# Altium schematic sheet keymap.SchDoc
size A3; Organization: Develer s.r.l.; Address1: via Mugellese 1/A; Address2: 50019 Campi Bisenzio; Address3: Firenze; Address4: ITALY; Revision: A; SheetNumber: 1; SheetTotal: 1
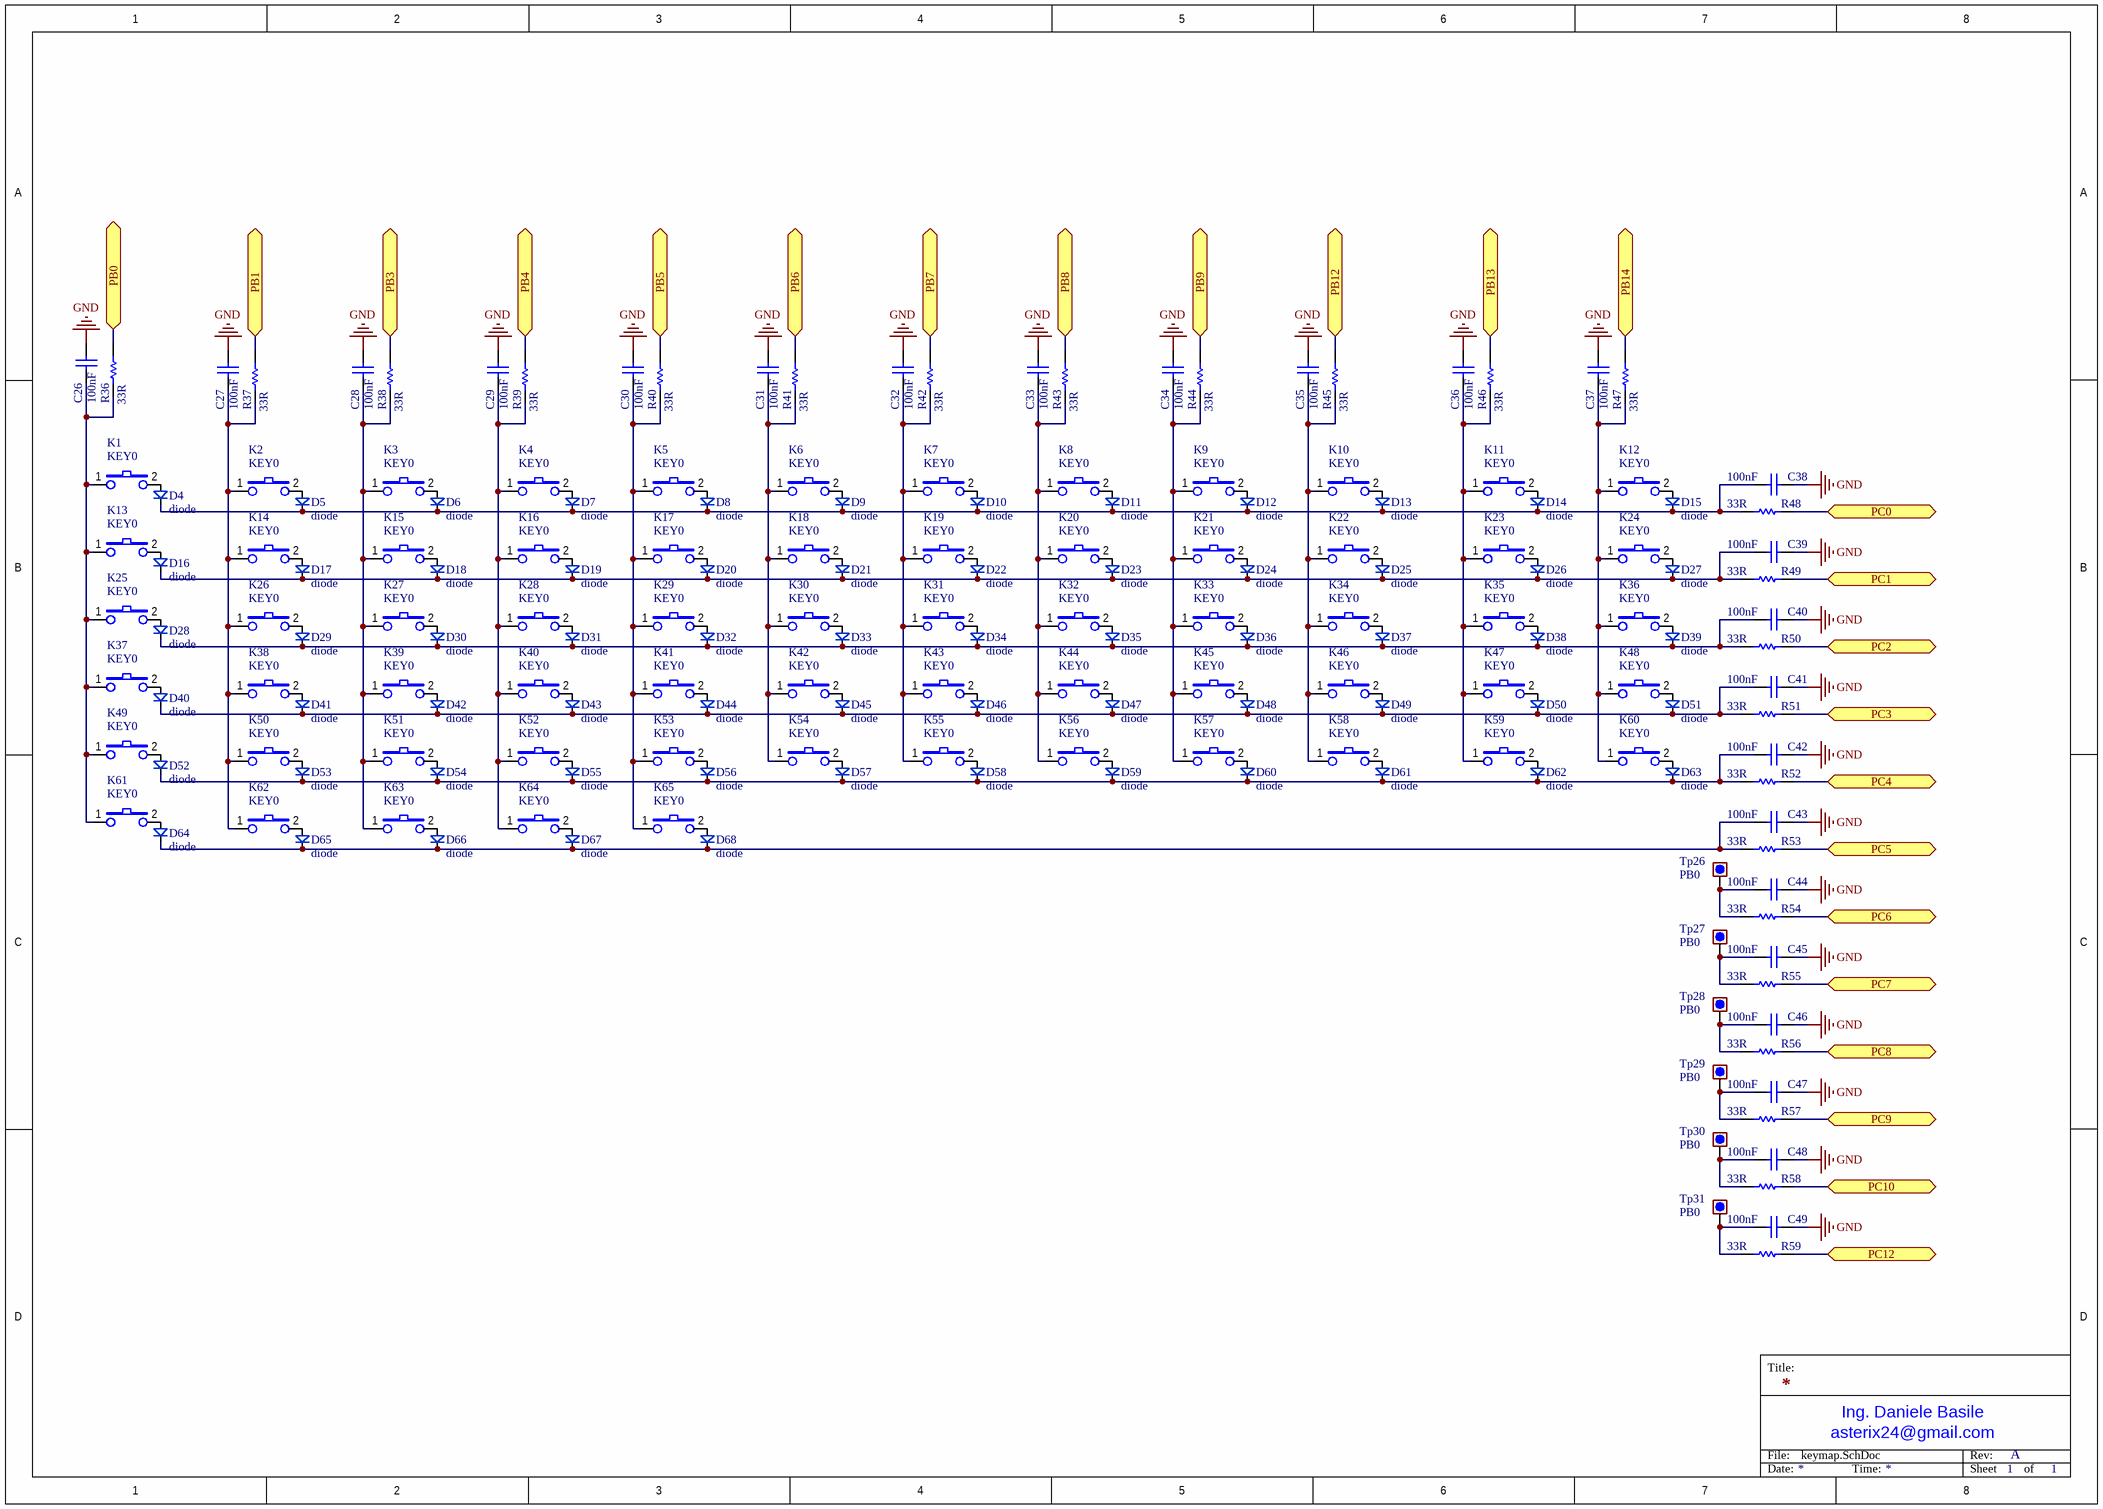
[diagram p0: keymap.SchDoc]

## Parts
C26  100nF  [0603_[1608]]
C27  100nF  [0603_[1608]]
C28  100nF  [0603_[1608]]
C29  100nF  [0603_[1608]]
C30  100nF  [0603_[1608]]
C31  100nF  [0603_[1608]]
C32  100nF  [0603_[1608]]
C33  100nF  [0603_[1608]]
C34  100nF  [0603_[1608]]
C35  100nF  [0603_[1608]]
C36  100nF  [0603_[1608]]
C37  100nF  [0603_[1608]]
C38  100nF  [0603_[1608]]
C39  100nF  [0603_[1608]]
C40  100nF  [0603_[1608]]
C41  100nF  [0603_[1608]]
C42  100nF  [0603_[1608]]
C43  100nF  [0603_[1608]]
C44  100nF  [0603_[1608]]
C45  100nF  [0603_[1608]]
C46  100nF  [0603_[1608]]
C47  100nF  [0603_[1608]]
C48  100nF  [0603_[1608]]
C49  100nF  [0603_[1608]]
D4  diode  [SOD-123]
D5  diode  [SOD-123]
D6  diode  [SOD-123]
D7  diode  [SOD-123]
D8  diode  [SOD-123]
D9  diode  [SOD-123]
D10  diode  [SOD-123]
D11  diode  [SOD-123]
D12  diode  [SOD-123]
D13  diode  [SOD-123]
D14  diode  [SOD-123]
D15  diode  [SOD-123]
D16  diode  [SOD-123]
D17  diode  [SOD-123]
D18  diode  [SOD-123]
D19  diode  [SOD-123]
D20  diode  [SOD-123]
D21  diode  [SOD-123]
D22  diode  [SOD-123]
D23  diode  [SOD-123]
D24  diode  [SOD-123]
D25  diode  [SOD-123]
D26  diode  [SOD-123]
D27  diode  [SOD-123]
D28  diode  [SOD-123]
D29  diode  [SOD-123]
D30  diode  [SOD-123]
D31  diode  [SOD-123]
D32  diode  [SOD-123]
D33  diode  [SOD-123]
D34  diode  [SOD-123]
D35  diode  [SOD-123]
D36  diode  [SOD-123]
D37  diode  [SOD-123]
D38  diode  [SOD-123]
D39  diode  [SOD-123]
D40  diode  [SOD-123]
D41  diode  [SOD-123]
D42  diode  [SOD-123]
D43  diode  [SOD-123]
D44  diode  [SOD-123]
D45  diode  [SOD-123]
D46  diode  [SOD-123]
D47  diode  [SOD-123]
D48  diode  [SOD-123]
D49  diode  [SOD-123]
D50  diode  [SOD-123]
D51  diode  [SOD-123]
D52  diode  [SOD-123]
D53  diode  [SOD-123]
D54  diode  [SOD-123]
D55  diode  [SOD-123]
D56  diode  [SOD-123]
D57  diode  [SOD-123]
D58  diode  [SOD-123]
D59  diode  [SOD-123]
D60  diode  [SOD-123]
D61  diode  [SOD-123]
D62  diode  [SOD-123]
D63  diode  [SOD-123]
D64  diode  [SOD-123]
D65  diode  [SOD-123]
D66  diode  [SOD-123]
D67  diode  [SOD-123]
D68  diode  [SOD-123]
K1  KEY0  [tactile_switch_gateron_pcb]
K2  KEY0  [tactile_switch_gateron_pcb]
K3  KEY0  [tactile_switch_gateron_pcb]
K4  KEY0  [tactile_switch_gateron_pcb]
K5  KEY0  [tactile_switch_gateron_pcb]
K6  KEY0  [tactile_switch_gateron_pcb]
K7  KEY0  [tactile_switch_gateron_pcb]
K8  KEY0  [tactile_switch_gateron_pcb]
K9  KEY0  [tactile_switch_gateron_pcb]
K10  KEY0  [tactile_switch_gateron_pcb]
K11  KEY0  [tactile_switch_gateron_pcb]
K12  KEY0  [tactile_switch_gateron_pcb]
K13  KEY0  [tactile_switch_gateron_pcb]
K14  KEY0  [tactile_switch_gateron_pcb]
K15  KEY0  [tactile_switch_gateron_pcb]
K16  KEY0  [tactile_switch_gateron_pcb]
K17  KEY0  [tactile_switch_gateron_pcb]
K18  KEY0  [tactile_switch_gateron_pcb]
K19  KEY0  [tactile_switch_gateron_pcb]
K20  KEY0  [tactile_switch_gateron_pcb]
K21  KEY0  [tactile_switch_gateron_pcb]
K22  KEY0  [tactile_switch_gateron_pcb]
K23  KEY0  [tactile_switch_gateron_pcb]
K24  KEY0  [tactile_switch_gateron_pcb]
K25  KEY0  [tactile_switch_gateron_pcb]
K26  KEY0  [tactile_switch_gateron_pcb]
K27  KEY0  [tactile_switch_gateron_pcb]
K28  KEY0  [tactile_switch_gateron_pcb]
K29  KEY0  [tactile_switch_gateron_pcb]
K30  KEY0  [tactile_switch_gateron_pcb]
K31  KEY0  [tactile_switch_gateron_pcb]
K32  KEY0  [tactile_switch_gateron_pcb]
K33  KEY0  [tactile_switch_gateron_pcb]
K34  KEY0  [tactile_switch_gateron_pcb]
K35  KEY0  [tactile_switch_gateron_pcb]
K36  KEY0  [tactile_switch_gateron_pcb]
K37  KEY0  [tactile_switch_gateron_pcb]
K38  KEY0  [tactile_switch_gateron_pcb]
K39  KEY0  [tactile_switch_gateron_pcb]
K40  KEY0  [tactile_switch_gateron_pcb]
K41  KEY0  [tactile_switch_gateron_pcb]
K42  KEY0  [tactile_switch_gateron_pcb]
K43  KEY0  [tactile_switch_gateron_pcb]
K44  KEY0  [tactile_switch_gateron_pcb]
K45  KEY0  [tactile_switch_gateron_pcb]
K46  KEY0  [tactile_switch_gateron_pcb]
K47  KEY0  [tactile_switch_gateron_pcb]
K48  KEY0  [tactile_switch_gateron_pcb]
K49  KEY0  [tactile_switch_gateron_pcb]
K50  KEY0  [tactile_switch_gateron_pcb]
K51  KEY0  [tactile_switch_gateron_pcb]
K52  KEY0  [tactile_switch_gateron_pcb]
K53  KEY0  [tactile_switch_gateron_pcb]
K54  KEY0  [tactile_switch_gateron_pcb]
K55  KEY0  [tactile_switch_gateron_pcb]
K56  KEY0  [tactile_switch_gateron_pcb]
K57  KEY0  [tactile_switch_gateron_pcb]
K58  KEY0  [tactile_switch_gateron_pcb]
K59  KEY0  [tactile_switch_gateron_pcb]
K60  KEY0  [tactile_switch_gateron_pcb]
K61  KEY0  [tactile_switch_gateron_pcb]
K62  KEY0  [tactile_switch_gateron_pcb]
K63  KEY0  [tactile_switch_gateron_pcb]
K64  KEY0  [tactile_switch_gateron_pcb]
K65  KEY0  [tactile_switch_gateron_pcb]
R36  33R  [0603_[1608]]
R37  33R  [0603_[1608]]
R38  33R  [0603_[1608]]
R39  33R  [0603_[1608]]
R40  33R  [0603_[1608]]
R41  33R  [0603_[1608]]
R42  33R  [0603_[1608]]
R43  33R  [0603_[1608]]
R44  33R  [0603_[1608]]
R45  33R  [0603_[1608]]
R46  33R  [0603_[1608]]
R47  33R  [0603_[1608]]
R48  33R  [0603_[1608]]
R49  33R  [0603_[1608]]
R50  33R  [0603_[1608]]
R51  33R  [0603_[1608]]
R52  33R  [0603_[1608]]
R53  33R  [0603_[1608]]
R54  33R  [0603_[1608]]
R55  33R  [0603_[1608]]
R56  33R  [0603_[1608]]
R57  33R  [0603_[1608]]
R58  33R  [0603_[1608]]
R59  33R  [0603_[1608]]
Tp26  PB0  [TEST_POINT_THD_D1.8MM]  (no BOM)
Tp27  PB0  [TEST_POINT_THD_D1.8MM]  (no BOM)
Tp28  PB0  [TEST_POINT_THD_D1.8MM]  (no BOM)
Tp29  PB0  [TEST_POINT_THD_D1.8MM]  (no BOM)
Tp30  PB0  [TEST_POINT_THD_D1.8MM]  (no BOM)
Tp31  PB0  [TEST_POINT_THD_D1.8MM]  (no BOM)

## Ports
PB0, PB1, PB3, PB4, PB5, PB6, PB7, PB8, PB9, PB12, PB13, PB14, PC0, PC1, PC2, PC3, PC4, PC5, PC6, PC7, PC8, PC9, PC10, PC12

## Nets
GND: C26.2 C27.2 C28.2 C29.2 C30.2 C31.2 C32.2 C33.2 C34.2 C35.2 C36.2 C37.2 C38.2 C39.2 C40.2 C41.2 C42.2 C43.2 C44.2 C45.2 C46.2 C47.2 C48.2 C49.2
PB0: R36.2 ; port PB0
PB1: R37.2 ; port PB1
PB3: R38.2 ; port PB3
PB4: R39.2 ; port PB4
PB5: R40.2 ; port PB5
PB6: R41.2 ; port PB6
PB7: R42.2 ; port PB7
PB8: R43.2 ; port PB8
PB9: R44.2 ; port PB9
PB12: R45.2 ; port PB12
PB13: R46.2 ; port PB13
PB14: R47.2 ; port PB14
PC0: R48.2 ; port PC0
PC1: R49.2 ; port PC1
PC2: R50.2 ; port PC2
PC3: R51.2 ; port PC3
PC4: R52.2 ; port PC4
PC5: R53.2 ; port PC5
PC6: R54.2 ; port PC6
PC7: R55.2 ; port PC7
PC8: R56.2 ; port PC8
PC9: R57.2 ; port PC9
PC10: R58.2 ; port PC10
PC12: R59.2 ; port PC12
NetC26_1: C26.1 K1.1 K13.1 K25.1 K37.1 K49.1 K61.1 R36.1
NetC27_1: C27.1 K2.1 K14.1 K26.1 K38.1 K50.1 K62.1 R37.1
NetC28_1: C28.1 K3.1 K15.1 K27.1 K39.1 K51.1 K63.1 R38.1
NetC29_1: C29.1 K4.1 K16.1 K28.1 K40.1 K52.1 K64.1 R39.1
NetC30_1: C30.1 K5.1 K17.1 K29.1 K41.1 K53.1 K65.1 R40.1
NetC31_1: C31.1 K6.1 K18.1 K30.1 K42.1 K54.1 R41.1
NetC32_1: C32.1 K7.1 K19.1 K31.1 K43.1 K55.1 R42.1
NetC33_1: C33.1 K8.1 K20.1 K32.1 K44.1 K56.1 R43.1
NetC34_1: C34.1 K9.1 K21.1 K33.1 K45.1 K57.1 R44.1
NetC35_1: C35.1 K10.1 K22.1 K34.1 K46.1 K58.1 R45.1
NetC36_1: C36.1 K11.1 K23.1 K35.1 K47.1 K59.1 R46.1
NetC37_1: C37.1 K12.1 K24.1 K36.1 K48.1 K60.1 R47.1
NetC38_1: C38.1 D4.1(K) D5.1(K) D6.1(K) D7.1(K) D8.1(K) D9.1(K) D10.1(K) D11.1(K) D12.1(K) D13.1(K) D14.1(K) D15.1(K) R48.1
NetC39_1: C39.1 D16.1(K) D17.1(K) D18.1(K) D19.1(K) D20.1(K) D21.1(K) D22.1(K) D23.1(K) D24.1(K) D25.1(K) D26.1(K) D27.1(K) R49.1
NetC40_1: C40.1 D28.1(K) D29.1(K) D30.1(K) D31.1(K) D32.1(K) D33.1(K) D34.1(K) D35.1(K) D36.1(K) D37.1(K) D38.1(K) D39.1(K) R50.1
NetC41_1: C41.1 D40.1(K) D41.1(K) D42.1(K) D43.1(K) D44.1(K) D45.1(K) D46.1(K) D47.1(K) D48.1(K) D49.1(K) D50.1(K) D51.1(K) R51.1
NetC42_1: C42.1 D52.1(K) D53.1(K) D54.1(K) D55.1(K) D56.1(K) D57.1(K) D58.1(K) D59.1(K) D60.1(K) D61.1(K) D62.1(K) D63.1(K) R52.1
NetC43_1: C43.1 D64.1(K) D65.1(K) D66.1(K) D67.1(K) D68.1(K) R53.1
NetC44_1: C44.1 R54.1 Tp26.1
NetC45_1: C45.1 R55.1 Tp27.1
NetC46_1: C46.1 R56.1 Tp28.1
NetC47_1: C47.1 R57.1 Tp29.1
NetC48_1: C48.1 R58.1 Tp30.1
NetC49_1: C49.1 R59.1 Tp31.1
NetD4_2: D4.2(A) K1.2
NetD5_2: D5.2(A) K2.2
NetD6_2: D6.2(A) K3.2
NetD7_2: D7.2(A) K4.2
NetD8_2: D8.2(A) K5.2
NetD9_2: D9.2(A) K6.2
NetD10_2: D10.2(A) K7.2
NetD11_2: D11.2(A) K8.2
NetD12_2: D12.2(A) K9.2
NetD13_2: D13.2(A) K10.2
NetD14_2: D14.2(A) K11.2
NetD15_2: D15.2(A) K12.2
NetD16_2: D16.2(A) K13.2
NetD17_2: D17.2(A) K14.2
NetD18_2: D18.2(A) K15.2
NetD19_2: D19.2(A) K16.2
NetD20_2: D20.2(A) K17.2
NetD21_2: D21.2(A) K18.2
NetD22_2: D22.2(A) K19.2
NetD23_2: D23.2(A) K20.2
NetD24_2: D24.2(A) K21.2
NetD25_2: D25.2(A) K22.2
NetD26_2: D26.2(A) K23.2
NetD27_2: D27.2(A) K24.2
NetD28_2: D28.2(A) K25.2
NetD29_2: D29.2(A) K26.2
NetD30_2: D30.2(A) K27.2
NetD31_2: D31.2(A) K28.2
NetD32_2: D32.2(A) K29.2
NetD33_2: D33.2(A) K30.2
NetD34_2: D34.2(A) K31.2
NetD35_2: D35.2(A) K32.2
NetD36_2: D36.2(A) K33.2
NetD37_2: D37.2(A) K34.2
NetD38_2: D38.2(A) K35.2
NetD39_2: D39.2(A) K36.2
NetD40_2: D40.2(A) K37.2
NetD41_2: D41.2(A) K38.2
NetD42_2: D42.2(A) K39.2
NetD43_2: D43.2(A) K40.2
NetD44_2: D44.2(A) K41.2
NetD45_2: D45.2(A) K42.2
NetD46_2: D46.2(A) K43.2
NetD47_2: D47.2(A) K44.2
NetD48_2: D48.2(A) K45.2
NetD49_2: D49.2(A) K46.2
NetD50_2: D50.2(A) K47.2
NetD51_2: D51.2(A) K48.2
NetD52_2: D52.2(A) K49.2
NetD53_2: D53.2(A) K50.2
NetD54_2: D54.2(A) K51.2
NetD55_2: D55.2(A) K52.2
NetD56_2: D56.2(A) K53.2
NetD57_2: D57.2(A) K54.2
NetD58_2: D58.2(A) K55.2
NetD59_2: D59.2(A) K56.2
NetD60_2: D60.2(A) K57.2
NetD61_2: D61.2(A) K58.2
NetD62_2: D62.2(A) K59.2
NetD63_2: D63.2(A) K60.2
NetD64_2: D64.2(A) K61.2
NetD65_2: D65.2(A) K62.2
NetD66_2: D66.2(A) K63.2
NetD67_2: D67.2(A) K64.2
NetD68_2: D68.2(A) K65.2

Not connected (* = marked no-connect by the designer): K1 3(GND) 4(GND); K2 3(GND) 4(GND); K3 3(GND) 4(GND); K4 3(GND) 4(GND); K5 3(GND) 4(GND); K6 3(GND) 4(GND); K7 3(GND) 4(GND); K8 3(GND) 4(GND); K9 3(GND) 4(GND); K10 3(GND) 4(GND); K11 3(GND) 4(GND); K12 3(GND) 4(GND); K13 3(GND) 4(GND); K14 3(GND) 4(GND); K15 3(GND) 4(GND); K16 3(GND) 4(GND); K17 3(GND) 4(GND); K18 3(GND) 4(GND); K19 3(GND) 4(GND); K20 3(GND) 4(GND); K21 3(GND) 4(GND); K22 3(GND) 4(GND); K23 3(GND) 4(GND); K24 3(GND) 4(GND); K25 3(GND) 4(GND); K26 3(GND) 4(GND); K27 3(GND) 4(GND); K28 3(GND) 4(GND); K29 3(GND) 4(GND); K30 3(GND) 4(GND); K31 3(GND) 4(GND); K32 3(GND) 4(GND); K33 3(GND) 4(GND); K34 3(GND) 4(GND); K35 3(GND) 4(GND); K36 3(GND) 4(GND); K37 3(GND) 4(GND); K38 3(GND) 4(GND); K39 3(GND) 4(GND); K40 3(GND) 4(GND); K41 3(GND) 4(GND); K42 3(GND) 4(GND); K43 3(GND) 4(GND); K44 3(GND) 4(GND); K45 3(GND) 4(GND); K46 3(GND) 4(GND); K47 3(GND) 4(GND); K48 3(GND) 4(GND); K49 3(GND) 4(GND); K50 3(GND) 4(GND); K51 3(GND) 4(GND); K52 3(GND) 4(GND); K53 3(GND) 4(GND); K54 3(GND) 4(GND); K55 3(GND) 4(GND); K56 3(GND) 4(GND); K57 3(GND) 4(GND); K58 3(GND) 4(GND); K59 3(GND) 4(GND); K60 3(GND) 4(GND); K61 3(GND) 4(GND); K62 3(GND) 4(GND); K63 3(GND) 4(GND); K64 3(GND) 4(GND); K65 3(GND) 4(GND)

## Notes on the sheet
- Title:
- File:
- asterix24@gmail.com
- Ing. Daniele Basile
- Rev:
- Date:
- Time:
- Sheet
- of

## Library data of the parts
C26-C49 = Cap: Ceramic X7R 50V; Value: 10nF; Published: 8-Jun-2000; Revision: July-2002: Re-released for DXP Platform.; Publisher: Altium Limited
D4-D68 = diode_small: Diode Schottky  low Vf, If 1A (PMEG3010ER; MBRX120LF)
K1-K65 = SWITCH-RA: Tactile Switch Right Angle 6x6; Part Number: Tyco FSMRA2JH; Purchase Code: RS 479-1520
R36-R59 = Res1: Resistor; Value: 1K; Published: 8-Jun-2000; Revision: July-2002: Re-released for DXP Platform.; Publisher: Altium Limited
Tp26-Tp31 = Test_point: Test point